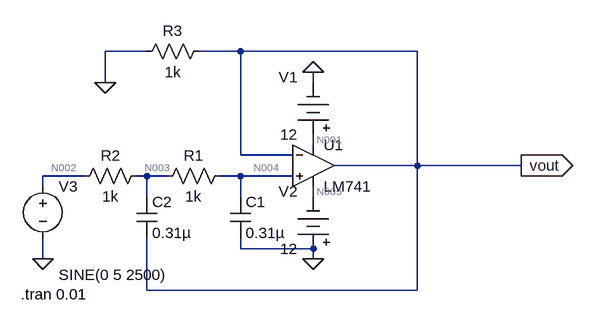
[diagram p0: schematic Draft1.asc]
Draft1.asc, the LTspice schematic file:
Version 4
SHEET 1 880 680
WIRE -48 0 -112 0
WIRE 96 0 32 0
WIRE 368 0 96 0
WIRE -112 48 -112 0
WIRE 208 48 208 32
WIRE 208 144 208 128
WIRE 96 160 96 0
WIRE 176 160 96 160
WIRE 368 176 368 0
WIRE 368 176 240 176
WIRE 528 176 368 176
WIRE -144 192 -208 192
WIRE -48 192 -64 192
WIRE -16 192 -48 192
WIRE 96 192 64 192
WIRE 176 192 96 192
WIRE -208 208 -208 192
WIRE -48 224 -48 192
WIRE 96 224 96 192
WIRE 208 224 208 208
WIRE 96 304 96 288
WIRE 208 304 96 304
WIRE -208 320 -208 288
WIRE 208 320 208 304
WIRE -48 368 -48 288
WIRE 368 368 368 176
WIRE 368 368 -48 368
FLAG 208 32 0
FLAG 208 320 0
FLAG 528 176 vout
IOPIN 528 176 Out
FLAG -208 320 0
FLAG -112 48 0
SYMBOL OpAmps\\LM741 208 112 R0
SYMATTR InstName U1
SYMBOL Misc\\battery 208 144 R180
WINDOW 0 24 104 Left 2
WINDOW 3 24 16 Left 2
WINDOW 123 0 0 Left 0
WINDOW 39 0 0 Left 0
SYMATTR InstName V1
SYMATTR Value 12
SYMBOL Misc\\battery 208 320 R180
WINDOW 0 24 104 Left 2
WINDOW 3 24 16 Left 2
WINDOW 123 0 0 Left 0
WINDOW 39 0 0 Left 0
SYMATTR InstName V2
SYMATTR Value 12
SYMBOL cap 80 224 R0
SYMATTR InstName C1
SYMATTR Value 0.31µ
SYMBOL cap -64 224 R0
SYMATTR InstName C2
SYMATTR Value 0.31µ
SYMBOL res 80 176 R90
WINDOW 0 0 56 VBottom 2
WINDOW 3 32 56 VTop 2
SYMATTR InstName R1
SYMATTR Value 1k
SYMBOL res -48 176 R90
WINDOW 0 0 56 VBottom 2
WINDOW 3 32 56 VTop 2
SYMATTR InstName R2
SYMATTR Value 1k
SYMBOL voltage -208 192 R0
WINDOW 3 24 152 Left 2
WINDOW 123 24 124 Left 2
WINDOW 39 0 0 Left 0
SYMATTR InstName V3
SYMATTR Value SINE(0 5 2500)
SYMBOL res 48 -16 R90
WINDOW 0 0 56 VBottom 2
WINDOW 3 32 56 VTop 2
SYMATTR InstName R3
SYMATTR Value 1k
TEXT -242 374 Left 2 !.tran 0.01

The netlist it stands for:
* Draft1.asc
XU1 N004 vout N001 N005 vout LM741  ; pins In+ In- V+ V- OUT
V1 N001 0 12
V2 0 N005 12
C1 N004 0 0.31µ
C2 N003 vout 0.31µ
R1 N004 N003 1k
R2 N003 N002 1k
V3 N002 0 SINE(0 5 2500)
R3 vout 0 1k
.tran 0.01
.lib LM741.lib
.backanno
.end

* Results of the author's LTspice run, read from the files saved beside the schematic
* Operating Point, zero values left out:
*   V(vout) = 884.3 µV
*   V(n004) = -115.7 µV
*   V(n005) = -12 V
*   V(n001) = 12 V
*   V(n003) = -57.86 µV
*   I(R3) = 884.3 nA
*   I(R2) = -57.86 nA
*   I(R1) = -57.86 nA
*   I(V3) = -57.86 nA
*   I(V2) = -1.626 mA
*   I(V1) = -1.627 mA
*   Ix(u1:1) = 57.86 nA
*   Ix(u1:2) = 101.9 nA
*   Ix(u1:99) = 1.627 mA
*   Ix(u1:50) = -1.626 mA
*   Ix(u1:28) = -986.1 nA
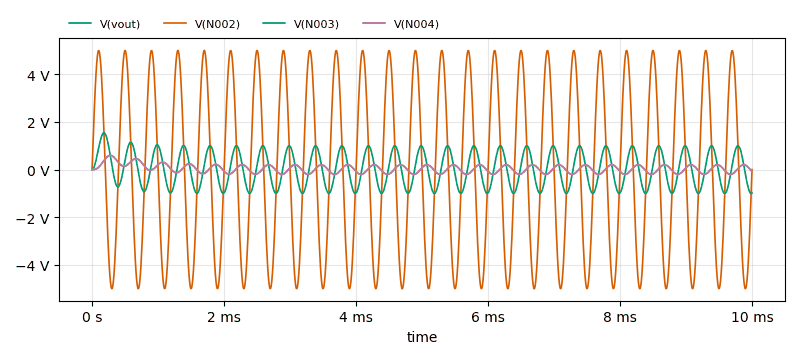
[diagram p1: Transient Analysis of Draft1.asc, plotted from the saved traces]
* Transient Analysis, 1 run:
*   V(vout): min -199.5 mV, max 593 mV, average 33.84 mV, rms 169.6 mV, last -77.55 mV
*   V(N002): min -5 V, max 5 V, average -8.462 µV, rms 3.535 V, last 0 V
*   V(N003): min -1.002 V, max 1.546 V, average 30.42 mV, rms 717.1 mV, last -983 mV
*   V(N004): min -200.5 mV, max 591.9 mV, average 32.83 mV, rms 169.4 mV, last -79.41 mV